# Altium project TSAL_Board_B.PrjPcb
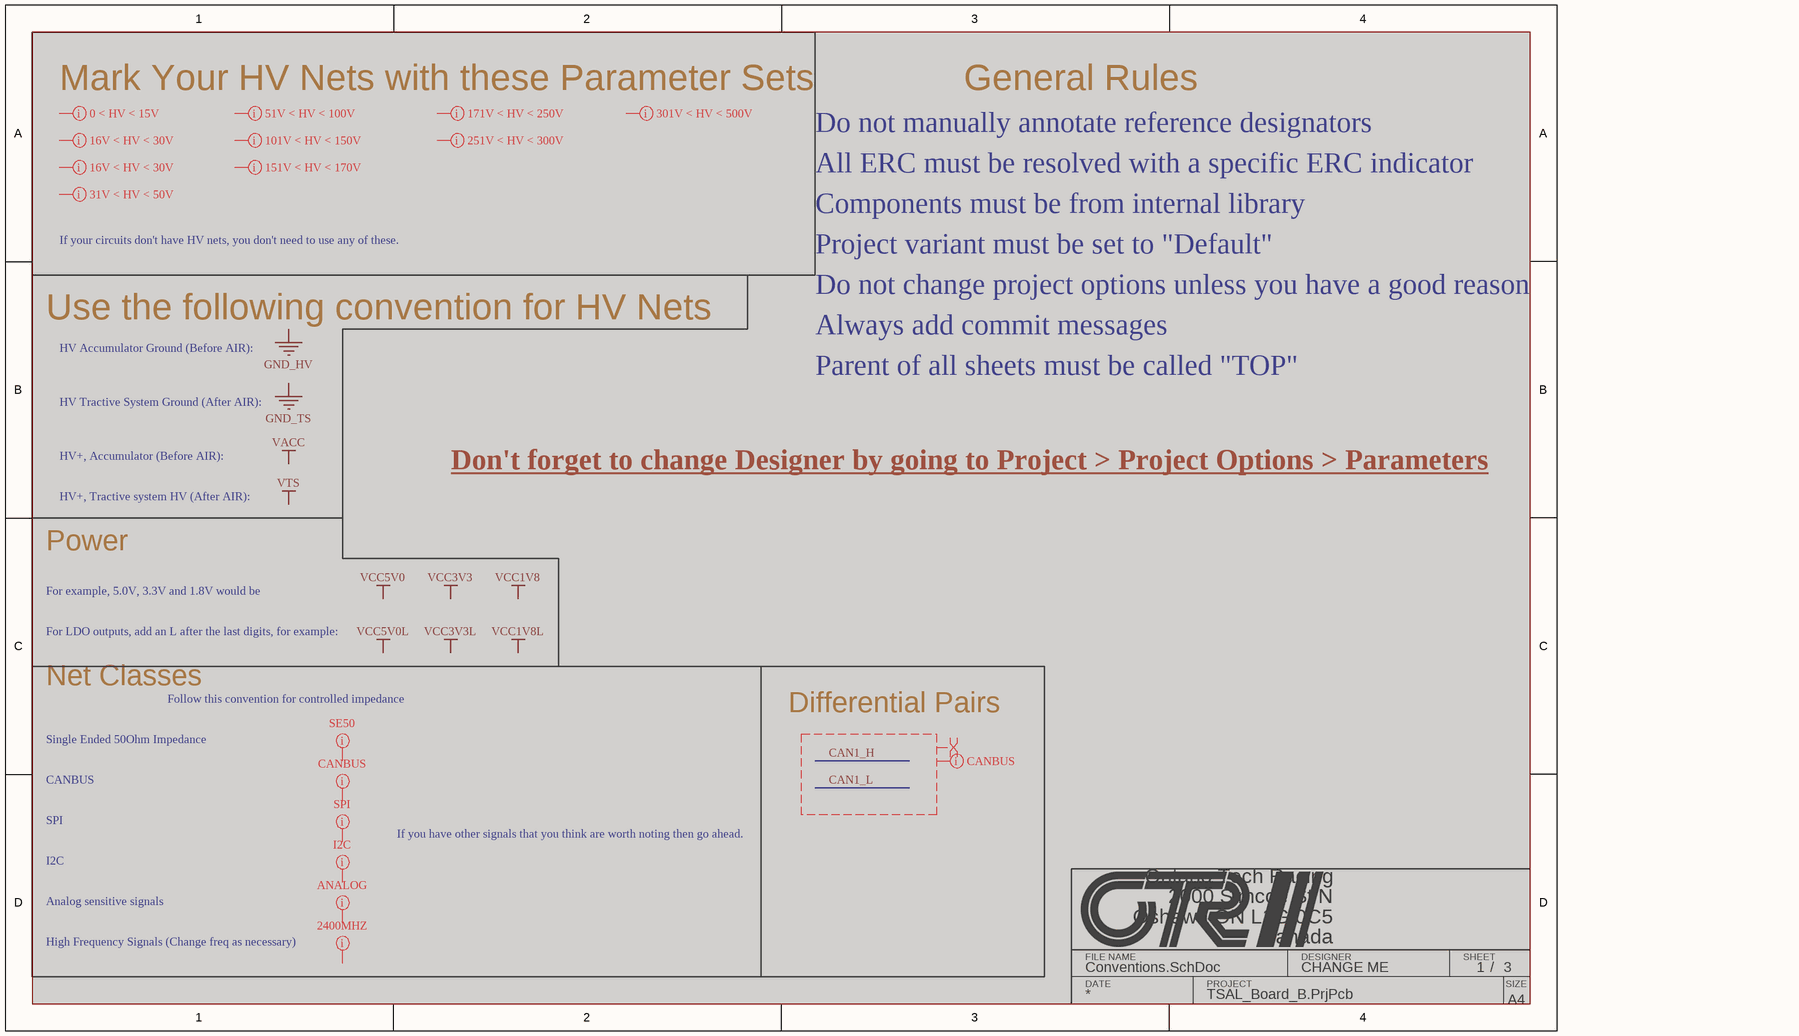
[diagram p0: Conventions.SchDoc]
DESIGNER: CHANGE ME
5 sheets, 61 parts. Net scope: hierarchical (ports join the sheet entries above them; power ports are global).
Board file: TSAL_Board_B.PcbDoc
Sheets:
  Conventions.SchDoc
  TSAL_Board_B.SchDoc
    U_TSSI = TSSI.SchDoc
      U_Red_Driver = Red_Driver.SchDoc
    U_RML = RML.SchDoc

## Sheet Conventions.SchDoc
size A4; SheetNumber: 1; SheetTotal: 3

### Layout directives
net class SE50: (no net found under the mark)
net class HV0_15: (no net found under the mark)
net class HV16_30: (no net found under the mark)
net class CANBUS: (no net found under the mark), CAN1_H, CAN1_L
net class SPI: (no net found under the mark)
net class I2C: (no net found under the mark)
net class ANALOG: (no net found under the mark)
net class 2400: (no net found under the mark)
differential pair: CAN1_H, CAN1_L

### Notes on the sheet
- Mark Your HV Nets with these Parameter Sets
- General Rules
- Do not manually annotate reference designators
- All ERC must be resolved with a specific ERC indicator
- If your circuits don't have HV nets, you don't need to use any of these.
- Components must be from internal library
- Project variant must be set to "Default"
- Do not change project options unless you have a good reason
- Use the following convention for HV Nets
- HV Accumulator Ground (Before AIR):
- Always add commit messages
- Parent of all sheets must be called "TOP"
- HV Tractive System Ground (After AIR):
- HV+, Tractive system HV (After AIR):
- HV+, Accumulator (Before AIR):
- Don't forget to change Designer by going to Project > Project Options > Parameters
- Power
- For example, 5.0V, 3.3V and 1.8V would be
- For LDO outputs, add an L after the last digits, for example:
- Net Classes
- Follow this convention for controlled impedance
- Differential Pairs
- Single Ended 50Ohm Impedance
- CANBUS
- SPI
- If you have other signals that you think are worth noting then go ahead.
- I2C
- Analog sensitive signals
- High Frequency Signals (Change freq as necessary)
- 2000 Simcoe St N
- Oshawa ON L1G 0C5
- Ontario Tech Racing
- FILE NAME
- DATE
- PROJECT
- DESIGNER
- Canada
- SHEET
- /
- A4
- SIZE

## Sheet TSAL_Board_B.SchDoc: TSAL CIRCUIT
size A; Revision: 1; SheetNumber: 2; SheetTotal: 7
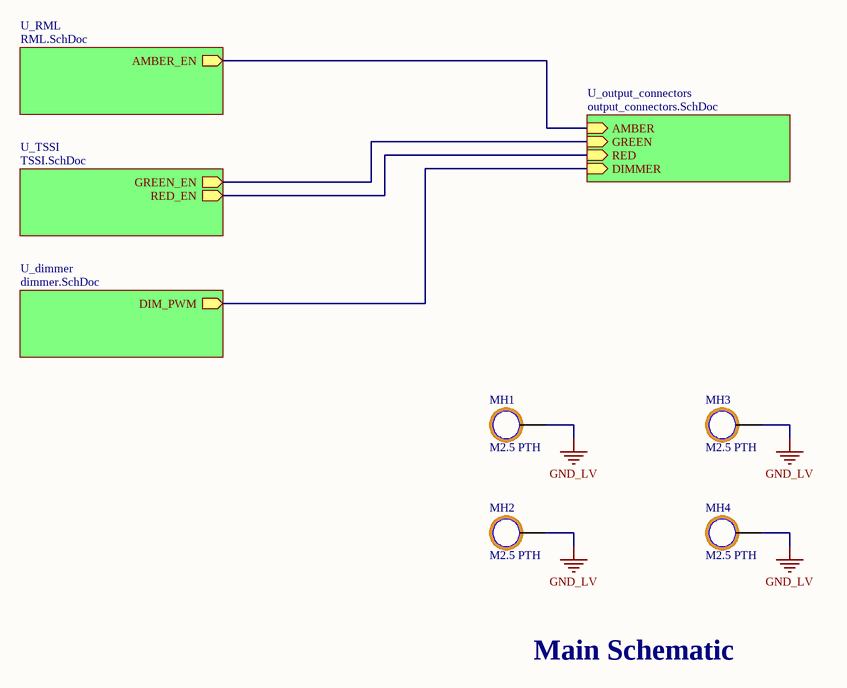
[diagram p1: TSAL_Board_B.SchDoc]

### Parts
MH1  M2.5 PTH  [MH__M2_5]  (no BOM)
MH2  M2.5 PTH  [MH__M2_5]  (no BOM)
MH3  M2.5 PTH  [MH__M2_5]  (no BOM)
MH4  M2.5 PTH  [MH__M2_5]  (no BOM)

### Sub-sheets
U_dimmer = dimmer.SchDoc (file not in this document): DIM_PWM (out)
U_output_connectors = output_connectors.SchDoc (file not in this document): AMBER (in), RED (in), GREEN (in), DIMMER (in)
U_RML = RML.SchDoc: AMBER_EN (out)
U_TSSI = TSSI.SchDoc: GREEN_EN (out), RED_EN (out)

### Nets
GND_LV: MH1.1 MH2.1 MH3.1 MH4.1
NetU4_4: sheet U_output_connectors/GREEN, sheet U_TSSI/GREEN_EN
NetU6_4: sheet U_output_connectors/RED, sheet U_TSSI/RED_EN
NetU7_4: sheet U_output_connectors/AMBER, sheet U_RML/AMBER_EN
(unnamed): sheet U_dimmer/DIM_PWM, sheet U_output_connectors/DIMMER

### Notes on the sheet
- Main Schematic

### Library data of the parts
MH1-MH4 = CMP-066-000000-1: Max Operating Temperature: °C; PN: M2.5 PTH; Min Operating Temperature: °C

## Sheet TSSI.SchDoc: TSSI CIRCUIT
size 406 x 254 mm; Revision: 1; SheetNumber: 5; SheetTotal: 7
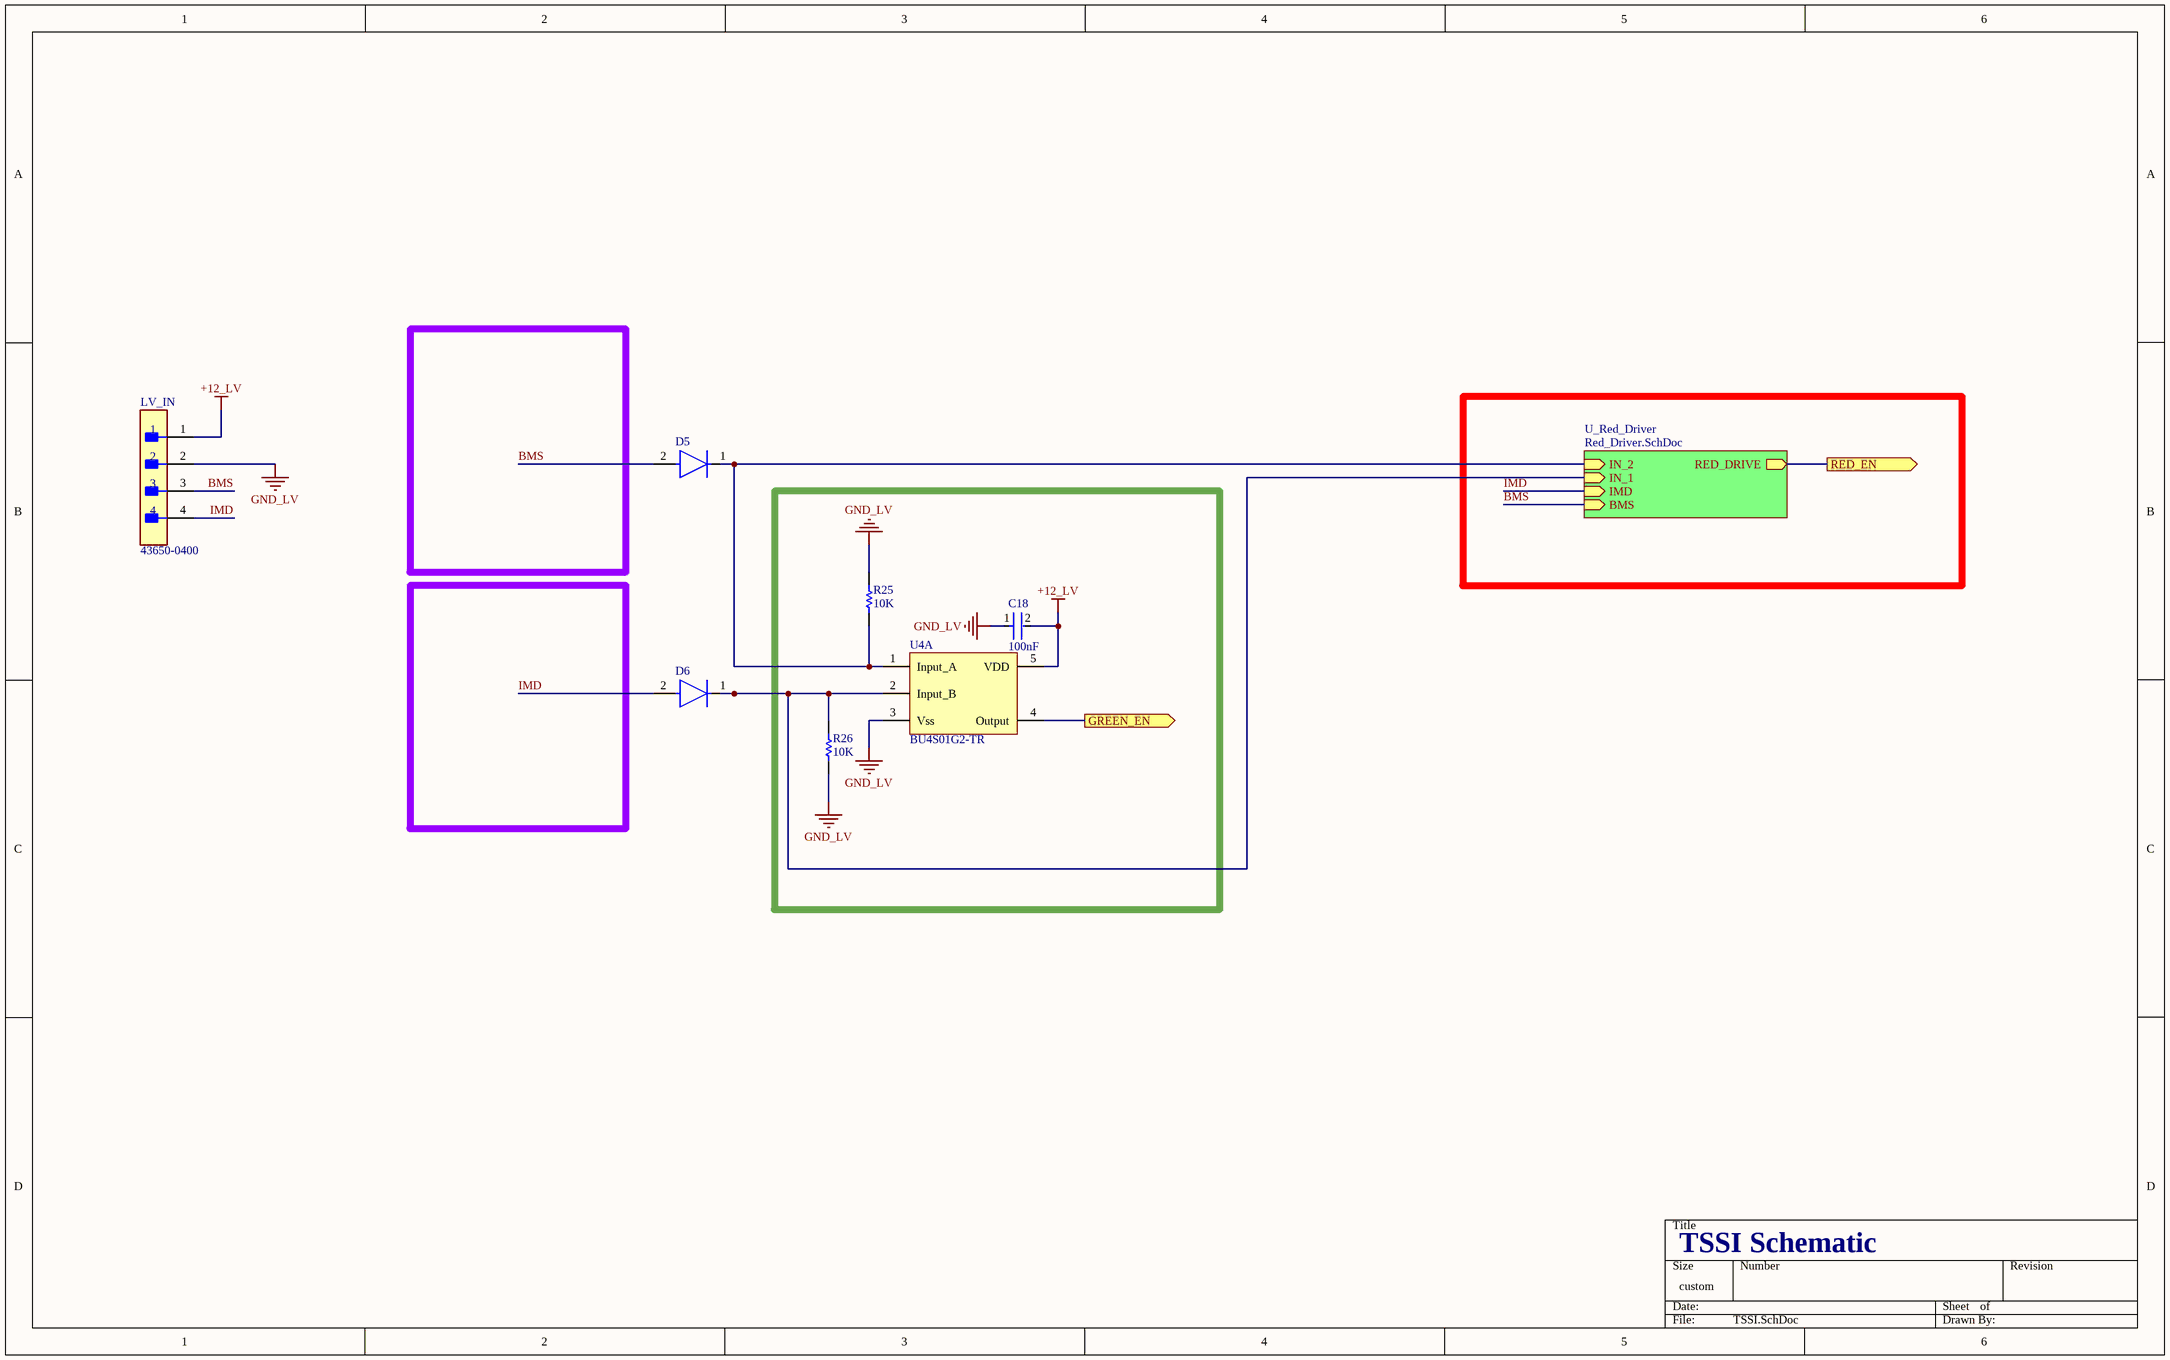
[diagram p2: TSSI.SchDoc]

### Parts
C18  100nF  [FP-C1206C-EB-MFG]
D5  DO-204AH_8_CENTRALSEMI_1  [FP-JANTXV1N486B-MFG]  (value not drawn)
D6  DO-204AH_8_CENTRALSEMI_1  [FP-JANTXV1N486B-MFG]  (value not drawn)
LV_IN  43650-0400  [FP-0436500400-MFG]
R25  10K  [R_1206_YAGEO_AC]
R26  10K  [R_1206_YAGEO_AC]
U4  BU4S01G2-TR  [SOT23__ROHM_SEMICONDUCTOR_TSZ02201]  (part A of 3)

### Sub-sheets
U_Red_Driver = Red_Driver.SchDoc: IN_2 (in), IN_1 (in), RED_DRIVE (out), IMD (in), BMS (in)

### Ports
GREEN_EN (out), RED_EN (out)

### Nets
+12_LV: C18.2 LV_IN.1 U4.5(VDD)
GND_LV: C18.1 LV_IN.2 R25.1 R26.2 U4.3(Vss)
BMS: D5.2(A) LV_IN.3 ; sheet U_Red_Driver/BMS
IMD: D6.2(A) LV_IN.4 ; sheet U_Red_Driver/IMD
NetBMS_TP_1: D6.1(C) R26.1 U4.2(Input_B) ; sheet U_Red_Driver/IN_1
NetD5_1: D5.1(C) R25.2 U4.1(Input_A) ; sheet U_Red_Driver/IN_2
NetU4_4: U4.4(Output) ; port GREEN_EN
NetU6_4: port RED_EN, sheet U_Red_Driver/RED_DRIVE

### Notes on the sheet
- TSSI Schematic

### Library data of the parts
C18 = CMP-03020-000153-1: CAP CER 0.1UF 100V X7R 1206; Manufacturer: KEMET; Manufacturer Part Number: C1206C104K1RACTU; Value: 0.10 μF; Tolerance: 0.1; Material: Ceramic; Temperature Coefficient: 15%; Automotive Grade: Grade 0; Voltage Rating: 100 V; Automotive: Yes; Ipc Land Pattern Name: CAPC320160X78; Device Class L1: Passive Components; ComponentLink2Description: Datasheet; Temperature Range Low: -55°C; Category: Cap; Octopart: https://octopart.com/c1206c104k1ractu-kemet-89521; Height: 0.88mm; Lead Free: Yes; Digikey Description: CAP CER 0.1UF 100V X7R 1206; Mouser Description: CAP CER 0.1UF 100V X7R 1206; Device Class L3: Ceramic Capacitors; Device Class L2: Capacitors; ComponentLink2URL: https://content.kemet.com/datasheets/KEM_C1007_X8R_ULTRA_150C_SMD.pdf; Temperature Range High: +150°C; Temperature Characteristic: X7R; RoHS: TRUE; Capacitance: 0.10 μF; Package: C1206C-EB; Temperature: -55°C to +150°C
D5 D6 = CMP-00002-1: Diode 250 V 200mA Through Hole DO-35; Max Inverse Voltage: 250 V; Forward Voltage: 1 V; Max Inverse Current: 50 nA; Forward Current: 100 mA; Max Operating Temperature: 200°C; Case/Package: DO-204AH; ComponentLink1Description: Datasheet
LV_IN = CMP-00257-00298074-1: 43650-0400 Connector Wire to Board Header 4 Position 3mm Solder Right Angle Thru-Hole Tray; NexarPartId: 298074; Manufacturer Lifecycle Status: ACTIVE; Glow Wire Compliant: Compliant; Voltage Rating (DC): 250V; Plating: Tin; Number of Circuits: 4; Voltage Rating: 600V; Gender: Male; Current Rating: 5A; Connector Type: Plug, Socket; Contact Resistance: 10mΩ; Height: 4.5mm; Schedule B: 8536694040, 8536694040; Housing Color: Black; Orientation: Right Angle, Vertical; Housing Material: Thermoplastic; Number of Rows: 1; Halogen Free: Low Halogen; Flammability Rating: UL94 V-0; Length: 14.86mm; REACH SVHC: Unknown; Number of Positions: 4; RoHS: Compliant; Number of Contacts: 4; Contact Material: Brass; Pitch: 3mm; Voltage Rating (AC): 250V; Number of Pins: 4; Termination: Solder; Country of Origin: US; Radiation Hardening: No; Lifecycle Status: Production; Color: Black; Contact Plating: Tin; Lead Pitch: 3mm; Max Voltage Rating (AC): 600V; Mount: Cable, Through Hole; Lead Free: Contains Lead; Max Operating Temperature: 105°C; Depth: 3.6mm; Min Operating Temperature: -40°C
R25 R26 = CMP-078-000543-1: RES SMD 10K OHM 1% 1/4W 1206; Manufacturer: YAGEO; Max Power: 0.25W, 1/4W; PN: AC1206FR-0710KL; Package: 1206 (3216 Metric); Tolerance: 1%; ComponentLink1Description: Datasheet; Max Operating Temperature: 155°C; Min Operating Temperature: -55°C; ComponentLink1URL: https://www.yageo.com/upload/media/product/productsearch/datasheet/rchip/PYu-AC_51_RoHS_L_9.pdf; Resistance Raw: 10k; Resistance: 10k
U4 = CMP-003-000051-1: NOR Gate IC 1 Channel 5-SSOP; Manufacturer: Rohm Semiconductor; Min Voltage Supply: -0.3; Max Input Voltage: V(supply); Min Input Voltage: 0; Max Voltage Supply: 18; Max Operating Temputare: 85°C; Min Operating Temputare: 40°C; PN: BU4S01G2-TR; Datasheet: https://fscdn.rohm.com/en/products/databook/datasheet/ic/logic_switch/standard_logic/bu4s01g2tr-e.pdf; PartId: 1

## Sheet Red_Driver.SchDoc
size 381 x 241 mm; SheetNumber: 6; SheetTotal: 7
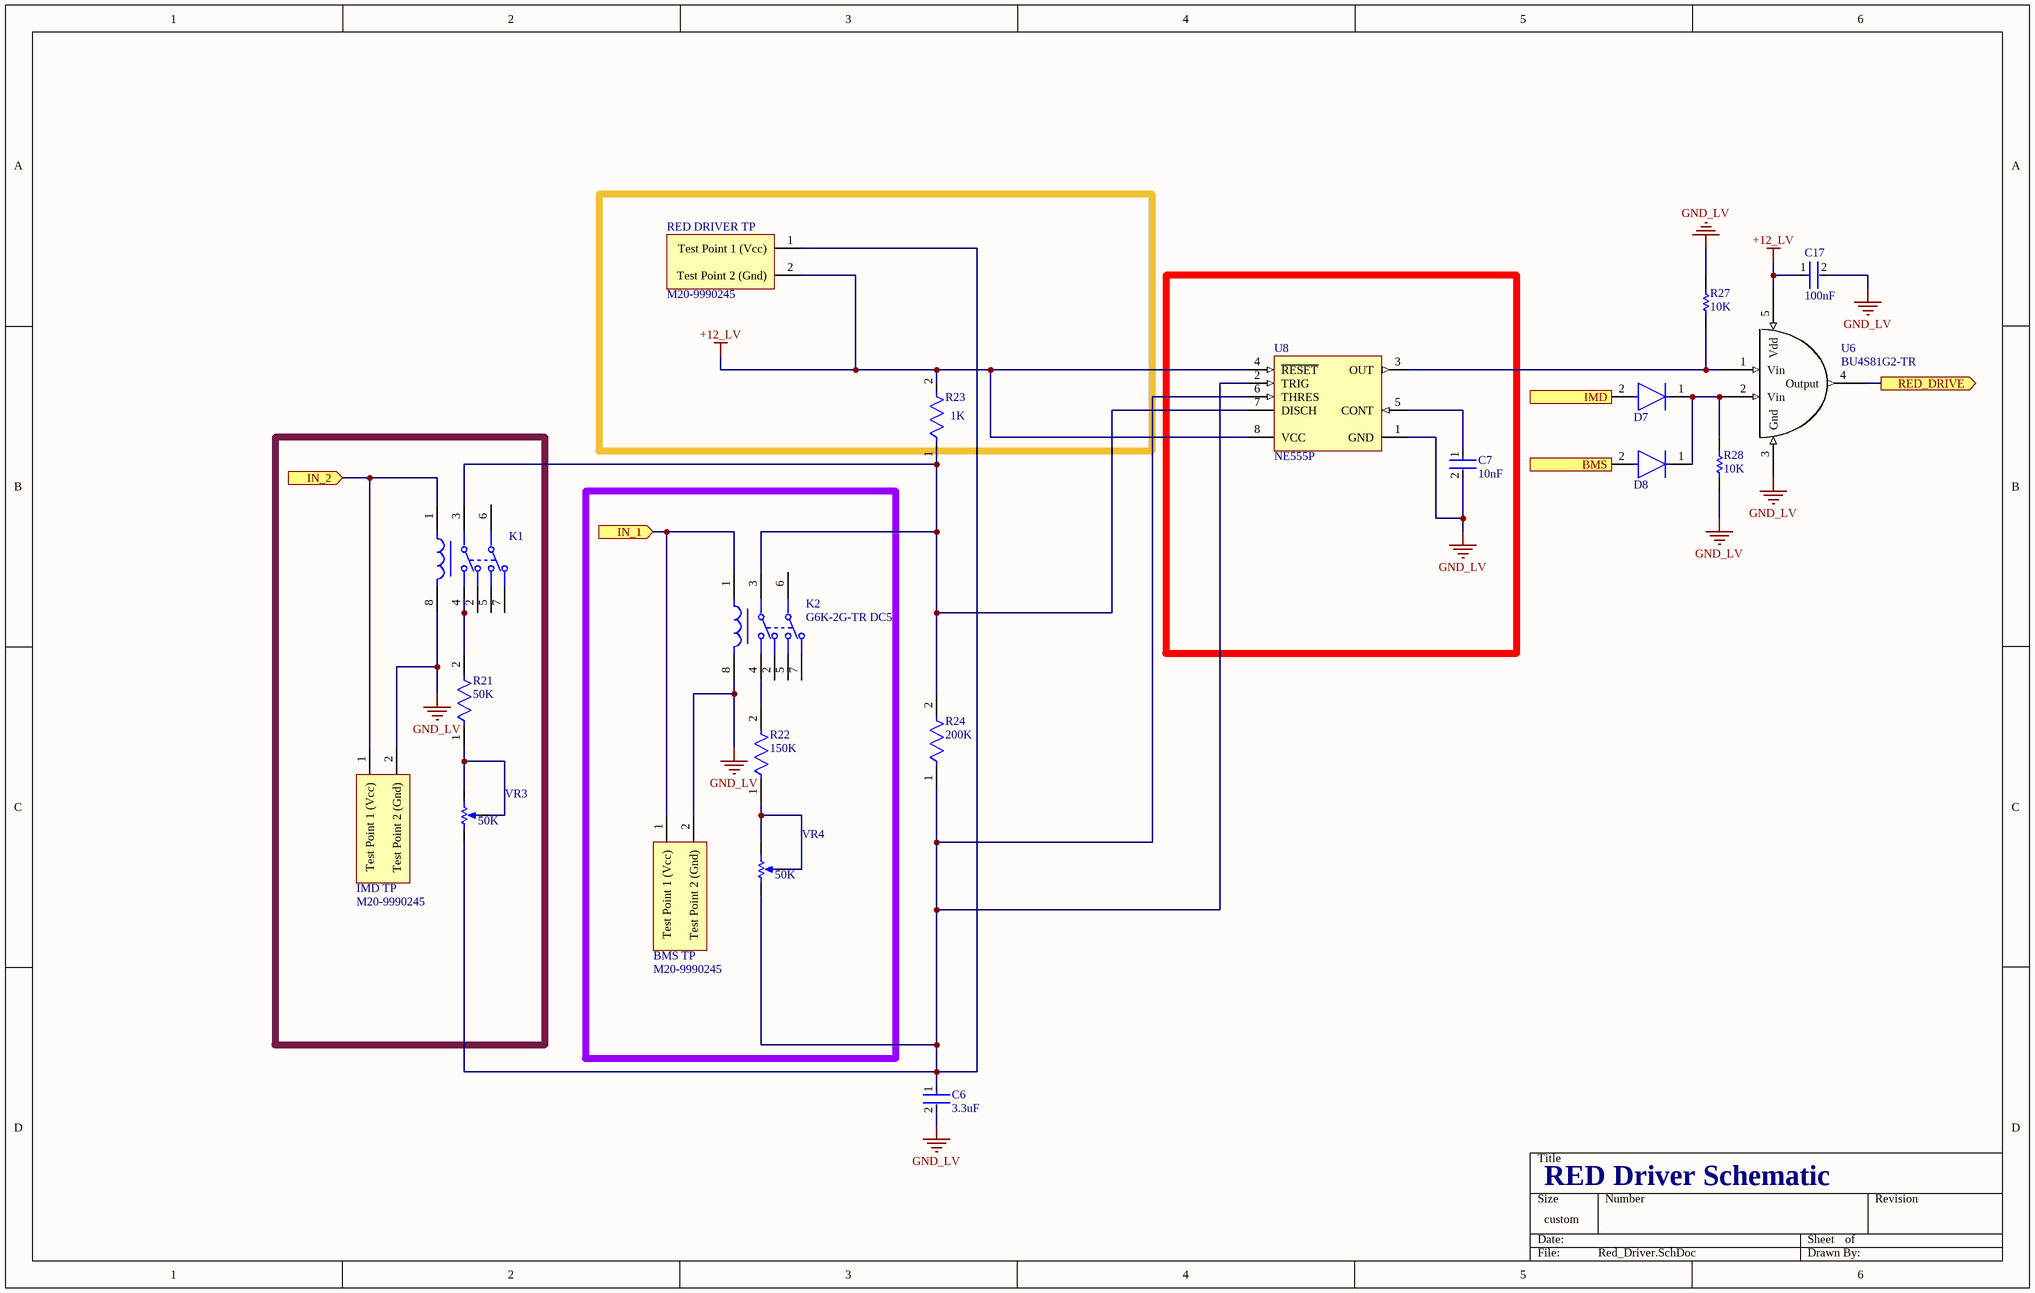
[diagram p3: Red_Driver.SchDoc]

### Parts
BMS_TP  M20-9990245  [12MM_HEADER__M20-9991245]
C6  3.3uF  [FP-RCE2K1-MFG]
C7  10nF  [FP-K155L2-MFG]
C17  100nF  [FP-C1206C-EB-MFG]
D7  DO-204AH_8_CENTRALSEMI_1  [FP-JANTXV1N486B-MFG]  (value not drawn)
D8  DO-204AH_8_CENTRALSEMI_1  [FP-JANTXV1N486B-MFG]  (value not drawn)
IMD_TP  M20-9990245  [12MM_HEADER__M20-9991245]
K1  G6K-2G-TR DC5  [FP-G6K-2G-TR_DC5-MFG]  (value not drawn)
K2  G6K-2G-TR DC5  [FP-G6K-2G-TR_DC5-MFG]
R21  50K  [RS00550K00FE73-Footprint-1]
R22  150K  [MFR-25FTE52-150K-Footprint-1]
R23  1K  [FP-RLR07-MFG]
R24  200K  [CFR-25JB-52-200K-Footprint-1]
R27  10K  [R_1206_YAGEO_AC]
R28  10K  [R_1206_YAGEO_AC]
RED_DRIVER_TP  M20-9990245  [12MM_HEADER__M20-9991245]
U6  BU4S81G2-TR  [SSOP5__ROHM_SEMICONDUCTOR__TSZ02201-0RDR0GZ00200-1-2]
U8  NE555P  [P0008A]
VR3  50K  [3006P-1-503LF-Footprint-1]
VR4  50K  [3006P-1-503LF-Footprint-1]

### Ports
BMS (in), IMD (in), IN_1 (in), IN_2 (in), RED_DRIVE (out)

### Nets
+12_LV: C17.1 R23.2 RED_DRIVER_TP.2(Test_Point_2_(Gnd)) U6.5(Vdd) U8.4(~{RESET}) U8.8(VCC)
GND_LV: BMS_TP.2(Test_Point_2_(Gnd)) C6.2 C7.2 C17.2 IMD_TP.2(Test_Point_2_(Gnd)) K1.8 K2.8 R27.1 R28.2 U6.3(Gnd) U8.1(GND)
BMS: D8.2(A) ; port BMS
IMD: D7.2(A) ; port IMD
NetBMS_TP_1: BMS_TP.1(Test_Point_1_(Vcc)) K2.1 ; port IN_1
NetC6_1: C6.1 R24.1 RED_DRIVER_TP.1(Test_Point_1_(Vcc)) U8.2(TRIG) U8.6(THRES) VR3.3(CW) VR4.3(CW)
NetC7_1: C7.1 U8.5(CONT)
NetD5_1: IMD_TP.1(Test_Point_1_(Vcc)) K1.1 ; port IN_2
NetD7_1: D7.1(C) D8.1(C) R28.1 U6.2(Vin)
NetK1_3: K1.3 K2.3 R23.1 R24.2 U8.7(DISCH)
NetK1_4: K1.4 R21.2
NetK2_4: K2.4 R22.2
NetR21_1: R21.1 VR3.1(CCW) VR3.2(WIPER)
NetR22_1: R22.1 VR4.1(CCW) VR4.2(WIPER)
NetR27_2: R27.2 U6.1(Vin) U8.3(OUT)
NetU6_4: U6.4(Output) ; port RED_DRIVE

Not connected (* = marked no-connect by the designer): K1 2 5 6 7; K2 2 5 6 7

### Notes on the sheet
- RED Driver Schematic

### Library data of the parts
BMS_TP IMD_TP RED_DRIVER_TP = CMP-081-000004-1: CONN HEADER VERT 2POS 2.54MM; Manufacturer: Harwin Inc.; PN: 952-2261-ND; Max Operating Temperature: 105 °C; Min Operating Temperature: -40 °C; ComponentLink1URL: https://www.digikey.ca/en/products/detail/harwin-inc/M20-9990245/3728225; ComponentLink1Description: Datasheet
C6 = CMP-00004-1: Ceramic Capacitor, Ceramic, 25V, 10% +Tol, 10% -Tol, X7R, -/+15ppm/Cel TC, 3.3uF, 2212; Reference Standard: AEC-Q200; Value: 3.3uF; Min Operating Temperature: -55°C; Tolerance (fill in as +-): 10%; Max Operating Temperature: 125°C; RoHS Compliant: Yes; Terminal Pitch: 5mm; Packaging: Ammo Pack; ComponentLink1Description: Datasheet; Rated DC Voltage (URdc): 25V; Width: 3.15mm; Temperature Characteristics Code: X7R; Package Style: RadialMeter; Height: 4mm; Capacitor Type: Ceramic; Reach SVHC Compliant: Yes; Case/Package: 2212; Length: 5.5mm; Dielectric Material: Ceramic; Pins: 2; Tolerance  (fill in as +-): 10%
C7 = CMP-00007-1: Ceramic Capacitor, Multilayer, Ceramic, 50V, 10% +Tol, 10% -Tol, X7R, 15% TC, 0.01uF, Through Hole Mount; Multilayer: Yes; Capacitor Type: Ceramic; Dielectric Material: Ceramic; Min Operating Temperature: -55°C; Terminal Finish: Tin; Package Shape: Rectangular; Packaging: Tape and Reel; Length: 4mm; Terminal Pitch: 2.5mm; Tolerance (fill in as +-): 10%; Value: 10nF; Tolerance  (fill in as +-): 10%; Mounting Technology: Through Hole; RoHS Compliant: Yes; JESD-609 Code: e3; Termination: Wire; ComponentLink1Description: Datasheet; Rated DC Voltage (URdc): 50V; Max Operating Temperature: 125°C; Package Style: RadialMeter; Pins: 2; Temperature Characteristics Code: X7R; Width: 2.5mm; Height: 5.58mm; Reach SVHC Compliant: Yes
C17 = CMP-03020-000153-1: as C18 on sheet TSSI; Voltage Rating: 100 V; Automotive: Yes; Ipc Land Pattern Name: CAPC320160X78; Device Class L1: Passive Components; ComponentLink2Description: Datasheet; Temperature Range Low: -55°C; Category: Cap; Octopart: https://octopart.com/c1206c104k1ractu-kemet-89521; Height: 0.88mm; Lead Free: Yes; Digikey Description: CAP CER 0.1UF 100V X7R 1206; Mouser Description: CAP CER 0.1UF 100V X7R 1206; Device Class L3: Ceramic Capacitors; Device Class L2: Capacitors; ComponentLink2URL: https://content.kemet.com/datasheets/KEM_C1007_X8R_ULTRA_150C_SMD.pdf; Temperature Range High: +150°C; Temperature Characteristic: X7R; RoHS: TRUE; Capacitance: 0.10 μF; Package: C1206C-EB; Temperature: -55°C to +150°C
D7 D8 = CMP-00002-1: as D5 on sheet TSSI; Max Operating Temperature: 200°C; Case/Package: DO-204AH; ComponentLink1Description: Datasheet
K1 K2 = CMP-08823-000110-1: RELAY TELECOM DPDT 1A 5VDC; RoHS Compliant: Yes
R21 = CMP-069-000013-1: Fixed Resistor, Wire Wound, 5W, 50000ohm, 1% +/-Tol, 20ppm/Cel, Through Hole Mount; Min Operating Temperature: -65°C; ComponentLink1Description: Datasheet; Max Operating Temperature: 250°C; Tolerance: 1%
R22 = CMP-069-000014-1: Fixed Resistor, Metal Film, 0.25W, 150000ohm, 250V, 1% +/-Tol, -50,50ppm/Cel; ComponentLink1Description: Datasheet
R23 = CMP-00030-39447724-1: RLR07C1001FSB14 Fixed Resistor, Metal Film, 0.25W, 1000ohm, 250V, 1% +/-Tol, 100ppm/Cel, Through Hole Mount; Wire/Cable Diameter: 50.8µm; Lead Diameter: 640µm; Max Power Dissipation: 250mW; Temperature Coefficient: 100ppm/°C; Resistance: 100Ω; Lead Length: 38.1mm; Voltage Rating: 250V; Lead Free: Contains Lead; REACH SVHC: Unknown; Packaging: Bulk; Military Standard: MIL-PRF-39017; Width: 2.29mm; Max Operating Temperature: 150°C; Length: 7.62mm; Min Operating Temperature: -65°C; Composition: Metal Film; Diameter: 2.29mm; Radiation Hardening: No; Features: Military, Moisture Resistant, Weldable; Failure Rate: 0.001%; Case/Package: Conformal; Tolerance: 1%; Voltage Rating (DC): 250V; Schedule B: 8533210090, 8533210090; RoHS: Non-Compliant; Termination: Axial; Power Rating: 250mW; Contact Plating: Lead, Tin; NexarPartId: 39447724; Number of Terminations: 2; Number of Pins: 14
R24 = CMP-069-000015-1: Fixed Resistor, Carbon Film, 0.25W, 200000ohm, 250V, 5% +/-Tol, -700,0ppm/Cel, Through Hole Mount; Min Operating Temperature: -55°C; Tolerance: 5%; ComponentLink1Description: Datasheet; Max Operating Temperature: 155°C
R27 R28 = CMP-078-000543-1: as R25 on sheet TSSI; Package: 1206 (3216 Metric); Tolerance: 1%; ComponentLink1Description: Datasheet; Max Operating Temperature: 155°C; Min Operating Temperature: -55°C; ComponentLink1URL: https://www.yageo.com/upload/media/product/productsearch/datasheet/rchip/PYu-AC_51_RoHS_L_9.pdf; Resistance Raw: 10k; Resistance: 10k
U6 = CMP-003-000056-1: IC GATE AND 1CH 2-INP 5SSOP; Min-Max Input: 0V - V(supp); Temputare Range: -40°C to +85°C; Min-Max Supply Voltage: 3V to 16V; PN: BU4S81G2-TR; Datasheet: https://fscdn.rohm.com/en/products/databook/datasheet/ic/logic_switch/standard_logic/bu4s81g2-e.pdf
U8 = CMP-2000-04954-1: Precision Timer, 4.5 to 16 V, 0 to 70 degC, 8-Pin DIP, Pb-Free, Tube; Manufacturer: TexasInstruments; Maximum High Level Output Current: -200mA; Number of Internal Timers: 1; Operating Supply Voltage: 5; Maximum Low Level Output Current: 200mA; Rad Hard: No; Packaging: Rail/Tube; Manufacturer URL: http://www.ti.com/; Package Reference: P8; Package Description: 8-Pin Double In-line Package, Body 9.59 x 6.35 mm, Pitch 2.54 mm; Package URL: http://www.ti.com/lit/ml/mpdi001b/mpdi001b.pdf; Type: Standard; Datasheet URL: http://www.ti.com/general/docs/lit/getliterature.tsp?genericPartNumber=NE555&fileType=pdf; Category: Timer; Package: 8PDIP; Datasheet Version: Rev. I, 09/2014
VR3 VR4 = CMP-069-000016-1: Trimmer, Cermet, 0.75W, 50000ohm, 400V, 10% +/-Tol, -100,100ppm/Cel, 15 Turn(s), 7519; Tolerance: 10%; ComponentLink1Description: Datasheet; Max Operating Temperature: 125°C; Min Operating Temperature: -55°C

## Sheet RML.SchDoc: RML CIRCUIT
size 482 x 304 mm; Revision: 1; SheetNumber: 7; SheetTotal: 7
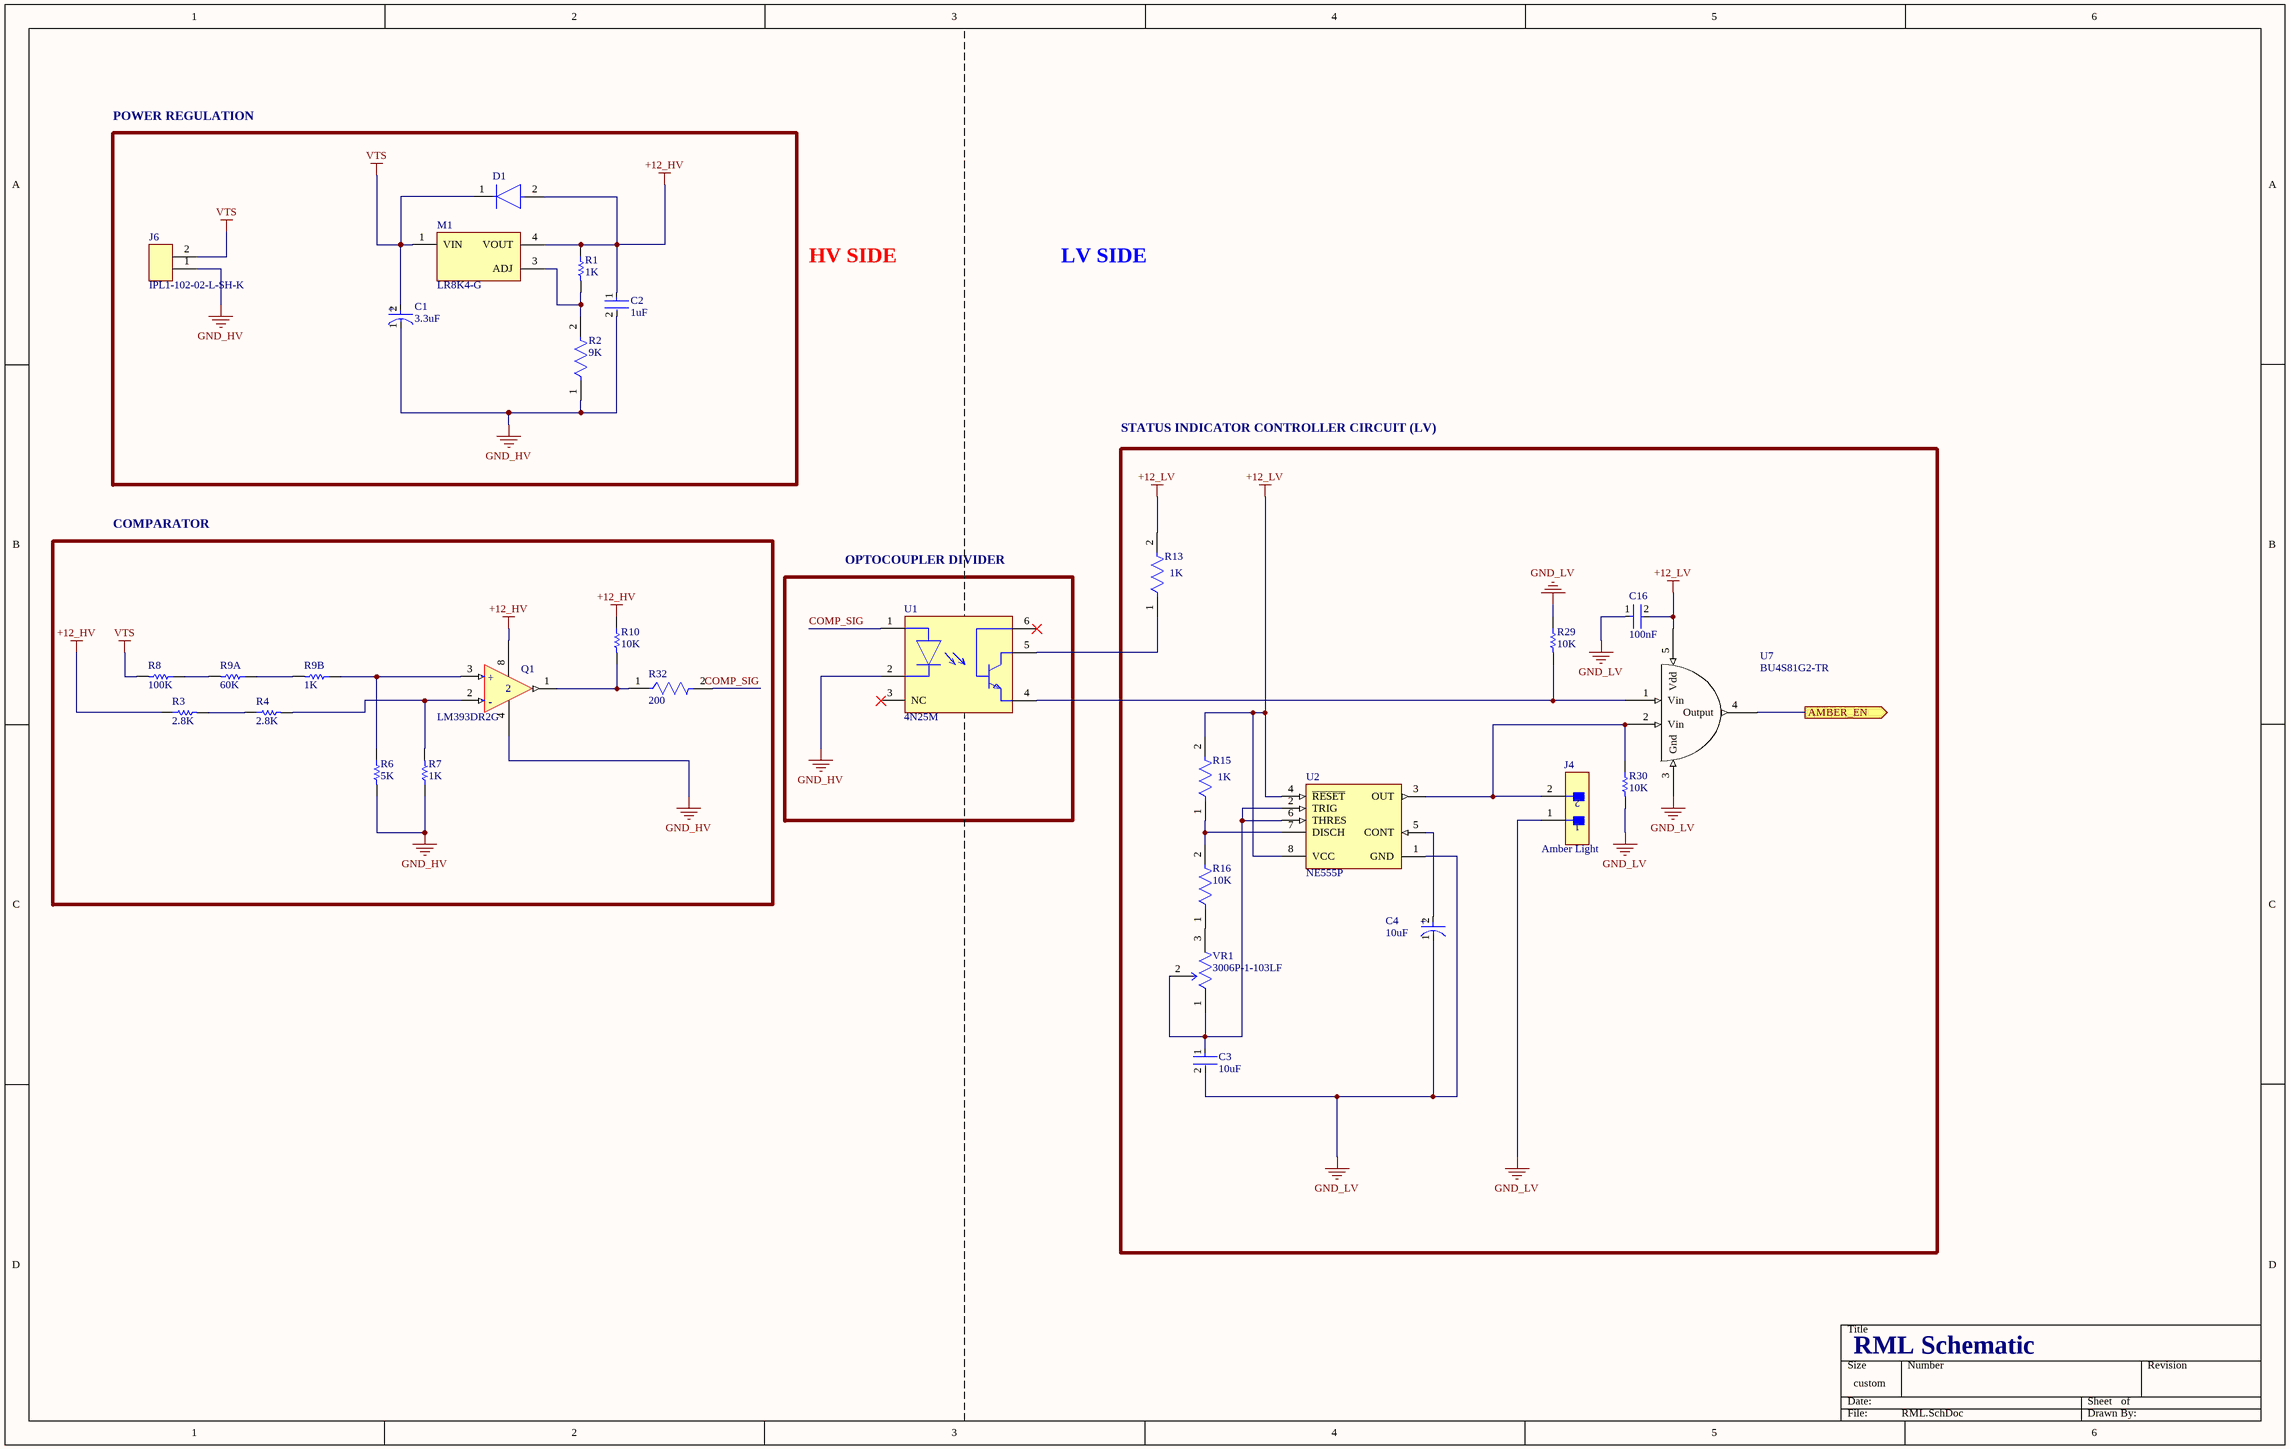
[diagram p4: RML.SchDoc]

### Parts
C1  3.3uF  [FP-RAD-TH-D_10_0_5-L_12_5-MFG]
C2  1uF  [FP-RCE2K1-MFG]
C3  10uF  [FP-RCE3DB-MFG]
C4  10uF  [FP-RAD-TH-D_5_0_5-L_11_1-MFG]
C16  100nF  [FP-C1206C-EB-MFG]
D1  1N4007-TP  [FP-1N4007-TP-MFG]  (value not drawn)
J4  Amber Light  [FP-M20-9990246-MFG]
J6  IPL1-102-02-L-SH-K  [J__SAMTEC_IPL1-102-02-XXX-SH-K]
M1  LR8K4-G  [FP-C04-189-MFG]
Q1  LM393DR2G  [SOIC8_ONSEMI_LM393DR2G_2N]
R1  1K  [R_1206_YAGEO_AC]
R2  9K  [FP-MCA1206-IPC_B]
R3  2.8K  [RESC3116X65X40ML10T20]
R4  2.8K  [RESC3116X65X40ML10T20]
R6  5K  [R_2512_YAGEO_AC]
R7  1K  [R_1206_YAGEO_AC]
R8  100K  [R_2512_YAGEO_AC]
R9A  60K  [RESC__2512__VISHAY_DALE__20035N]
R9B  1K  [R_2512_YAGEO_AC]
R10  10K  [R_1206_YAGEO_AC]
R13  1K  [FP-RLR07-MFG]
R15  1K  [FP-RLR07-MFG]
R16  10K  [FP-RLR07-MFG]
R29  10K  [R_1206_YAGEO_AC]
R30  10K  [R_1206_YAGEO_AC]
R32  200  [FP-RMCF1206-IPC_A]
U1  4N25M  [FP-646BX-MFG]
U2  NE555P  [P0008A]
U7  BU4S81G2-TR  [SSOP5__ROHM_SEMICONDUCTOR__TSZ02201-0RDR0GZ00200-1-2]
VR1  3006P-1-103LF  [FP-3006P-MFG]

### Blocks framed on the sheet
POWER REGULATION: C1 C2 D1 J6 M1 R1 R2
STATUS INDICATOR CONTROLLER CIRCUIT (LV): C3 C4 C16 J4 R13 R15 R16 R29 R30 U2 U7 VR1
COMPARATOR: Q1 R3 R4 R6-R8 R9A R9B R10 R32
OPTOCOUPLER DIVIDER: U1

### Ports
AMBER_EN (out)

### Nets
+12_HV: C2.1 D1.2(A) M1.4(VOUT) Q1.8(VCC_(+)) R1.1 R3.1 R10.1
+12_LV: C16.2 R13.2 R15.2 U2.4(~{RESET}) U2.8(VCC) U7.5(Vdd)
GND_HV: C1.1(C) C2.2 J6.1 Q1.4(VCC_(-)) R2.1 R6.2 R7.1 U1.2(C)
GND_LV: C3.2 C4.1(C) C16.1 J4.1 R29.1 R30.2 U2.1(GND) U7.3(Gnd)
VTS: C1.2(A) D1.1(C) J6.2 M1.1(VIN) R8.2
COMP_SIG: R32.2 U1.1(A)
NetC3_1: C3.1 U2.2(TRIG) U2.6(THRES) VR1.1(CCW) VR1.2(WIPER)
NetC4_2: C4.2(A) U2.5(CONT)
NetJ4_2: J4.2 R30.1 U2.3(OUT) U7.2(Vin)
NetM1_3: M1.3(ADJ) R1.2 R2.2
NetQ1_1: Q1.1(OUTPUT_B) R10.2 R32.1
NetQ1_2: Q1.2(INPUT_B-) R4.2 R7.2
NetQ1_3: Q1.3(INPUT_B+) R6.1 R9B.1
NetR3_2: R3.2 R4.1
NetR8_1: R8.1 R9A.2
NetR9A_1: R9A.1 R9B.2
NetR13_1: R13.1 U1.5(C)
NetR15_1: R15.1 R16.2 U2.7(DISCH)
NetR16_1: R16.1 VR1.3(CW)
NetR29_2: R29.2 U1.4(E) U7.1(Vin)
NetU7_4: U7.4(Output) ; port AMBER_EN

Not connected (* = marked no-connect by the designer): U1 3(NC)* 6(B)*

### Notes on the sheet
- HV SIDE
- LV SIDE
- RML Schematic
- (in symbol CMP-003-000045-1) +; -
- (in symbol CMP-00008-1) +
- (in symbol CMP-05427-001012-1) +

### Library data of the parts
C1 = CMP-05427-001012-1: Aluminum Electrolytic Capacitors (Radial Lead Type) 3.3uF ±20% 400V; Dielectric Material: Aluminium; Ripple Current (AC): 40mA; Lead/Base Style: Straight; Life (Hours): 2000Hour; Lead Diameter: 0.6mm; Polarity: Polar; Voltage Rating (DC): 400V; Max Operating Temperature: 105°C; Lead Pitch: 5mm; Termination: Radial; Lead Free: Lead Free; Radiation Hardening: No; Voltage Rating: 400V; Tolerance: 20%; Construction: RADIAL; Ripple Current: 40mA; Min Operating Temperature: -25°C; Diameter: 10mm; Contact Plating: Tin; Package Quantity: 200; Mount: Through Hole; REACH SVHC: No SVHC; Height: 12.5mm; Case/Package: Radial; Height - Seated (Max): 0.531inch; RoHS Compliant: Yes; Series: NHG; Capacitance: 3.3uF; Packaging: Bulk; Number of Pins: 2; Voltage: 400V; Length: 12.5mm
C2 = CMP-00005-1: Ceramic Capacitor, Multilayer, Ceramic, 100V, 10% +Tol, 10% -Tol, X7R, 15% TC, 1uF, Through Hole Mount, 2212; Reference Standard: AEC-Q200; Reach SVHC Compliant: Yes; Capacitor Type: Ceramic; Pins: 2; Value: 1uF; Package Style: RadialMeter; Length: 5.5mm; Dielectric Material: Ceramic; Packaging: Ammo Pack; Tolerance  (fill in as +-): 10%; Height: 4mm; ComponentLink1Description: Datasheet; Min Operating Temperature: -55°C; Terminal Pitch: 5mm; RoHS Compliant: Yes; Width: 3.15mm; Case/Package: 2212; Rated DC Voltage (URdc): 100V; Tolerance (fill in as +-): 10%; Max Operating Temperature: 125°C; Temperature Characteristics Code: X7R
C3 = CMP-00006-1: Ceramic Capacitor, Multilayer, Ceramic, 25V, 10% +Tol, 10% -Tol, X7R, 15% TC, 10uF, Through Hole Mount, 2216; Reference Standard: AEC-Q200; Reach SVHC Compliant: Yes; Dielectric Material: Ceramic; Tolerance  (fill in as +-): 10%; Min Operating Temperature: -55°C; Terminal Pitch: 2.5mm; ComponentLink1Description: Datasheet; Width: 4mm; Temperature Characteristics Code: X7R; Capacitor Type: Ceramic; Max Operating Temperature: 125°C; Length: 5.5mm; Case/Package: 2216; Tolerance (fill in as +-): 10%; Packaging: Ammo Pack; Height: 5mm; Rated DC Voltage (URdc): 25V; Pins: 2; RoHS Compliant: Yes; Package Style: RadialMeter; Value: 10uF
C4 = CMP-00008-1: Aluminum Electrolytic Capacitor, Polarized, Aluminum (wet), 50V, 20% +Tol, 20% -Tol, 10uF, Through Hole Mount; Manufacturer Series: NHG; Ripple Current: 39mA; Leakage Current: 5uA; Capacitor Type: Aluminium; Tan Delta: 0.12; Packaging: Tape and Reel; Termination: Wire; Value: 10uF; Reach SVHC Compliant: Yes; Terminal Finish: Tin; Diameter: 5mm; Min Operating Temperature: -55°C; Series: ECA-NHG; Max Operating Temperature: 105°C; Package Shape: Cylindrical; Rated DC Voltage (URdc): 50V; RoHS Compliant: Yes; Package Style: RadialMeter; Pins: 2; Tolerance (fill in as +-): 20%; Terminal Pitch: 2.5mm; Tolerance  (fill in as +-): 20%; Polarity: Polarized; Length: 11mm; ComponentLink1Description: Datasheet; Dielectric Material: Aluminium; Mounting Technology: Through Hole; JESD-609 Code: e3
C16 = CMP-03020-000153-1: as C18 on sheet TSSI; Voltage Rating: 100 V; Automotive: Yes; Ipc Land Pattern Name: CAPC320160X78; Device Class L1: Passive Components; ComponentLink2Description: Datasheet; Temperature Range Low: -55°C; Category: Cap; Octopart: https://octopart.com/c1206c104k1ractu-kemet-89521; Height: 0.88mm; Lead Free: Yes; Digikey Description: CAP CER 0.1UF 100V X7R 1206; Mouser Description: CAP CER 0.1UF 100V X7R 1206; Device Class L3: Ceramic Capacitors; Device Class L2: Capacitors; ComponentLink2URL: https://content.kemet.com/datasheets/KEM_C1007_X8R_ULTRA_150C_SMD.pdf; Temperature Range High: +150°C; Temperature Characteristic: X7R; RoHS: TRUE; Capacitance: 0.10 μF; Package: C1206C-EB; Temperature: -55°C to +150°C
D1 = CMP-56207-000011-1: DIODE GEN PURP 1KV 1A DO41; Max Surge Current: 30A; Recovery Time: 2000ns; Element Configuration: Single; Polarity: Standard; Reverse Recovery Time: 2us; Capacitance: 15pF; Forward Voltage: 1V; Max Reverse Current: 5uA; Radiation Hardening: No; Number of Pins: 2; Current Rating: 1A; Reverse Voltage: 1kV; Output Current: 1A; Mount: Through Hole; Average Rectified Current: 1A; Lead Free: Lead Free; Peak Non-Repetitive Surge Current: 30A; Max Reverse Voltage (DC): 1kV; Voltage Rating (DC): 1kV; Max Repetitive Reverse Voltage (Vrrm): 1kV; Diameter: 2.7mm; Forward Current: 1A; RoHS Compliant: Yes; Package Quantity: 1; Length: 5.2mm; Max Forward Surge Current (Ifsm): 30A; Packaging: Tape and Reel; Case/Package: DO-41; Min Operating Temperature: -55°C; Max Operating Temperature: 150°C
J4 = CMP-15831-000009-1: CONN HEADER VERT 2POS 2.54MM; Manufacturer: Harwin; Manufacturer Part Number: M20-9990246; Conn Gender: Male; Conn Orientation: Vertical; Number Of Contacts: 2; Current Rating: 3A; ComponentLink2URL: https://cdn.harwin.com/pdfs/M20-999.pdf; ComponentLink2Description: Datasheet; Package: M20-9990246; Temperature: -40°C to +105°C; Octopart: https://octopart.com/m20-9990246-harwin-2590635; Mouser Description: 2.54mm (0.1") Pitch SIL Vertical PC Tail Pin Header, 6.1mm mating pin height, tin, 2 contacts; Temperature Range High: +105°C; Device Class L1: Connectors; RoHS: TRUE; Automotive: No; Height: 8.99mm; Number Of Rows: 1; Contact Material: Tin,Nickel; Category: Conn; Pitch: 2.54mm; Lead Free: Yes; Digikey Description: CONN HEADER VERT 2POS 2.54MM; Temperature Range Low: -40°C; Device Class L3: unset; Device Class L2: Headers and Wire Housings
J6 = CMP-044-000010-1: Connector Header Surface Mount, Right Angle 2 position 0.100" (2.54mm); Manufacturer: Samtec; Current Rating: 3.8A; Voltage Rating (Working): 954VDC; Gender: Male; Pin Count: 2; PN: IPL1-102-02-L-SH-K; ComponentLink1Description: Datasheet; ComponentLink1URL: http://suddendocs.samtec.com/catalog_english/ipl1.pdf; Type: Surface-Mount
M1 = CMP-06324-000005-1: IC REG LINEAR POS ADJ 10MA TO252; Manufacturer: Microchip; Standoff Height: 0mm; Nominal Supply Current: 10uA; Min Supply Voltage: 13.2V; Number Of Outputs: 1; Max Power Dissipation: 2.5W; Description: Linear Voltage Regulator IC Positive Adjustable 1 Output 10mA TO-252, (D-Pak); Max Junction Temp: +125°C; Max Supply Voltage: 450V; Accuracy Percentage: 5%; Output Type: AdjustableProgrammable; Output Current: 0.3-30mA; Output Voltage: 1.2-440V; Device Class L1: Integrated Circuits (ICs); Temperature Range High: +125°C; RoHS: TRUE; Footprint Url: http://ww1.microchip.com/downloads/en/DeviceDoc/3L_DPAK_%28TO-252%29_U5X_C04-00189a.pdf; ComponentLink2Description: Datasheet; Ambient Temperature Range High: +85°C; Octopart: https://octopart.com/lr8k4-g-microchip-47153542; Mouser Description: Linear Voltage Regulators 450V Adj 3 Termnl; Device Class L3: Voltage Regulators - Linear; Height: 0.099inch; Device Class L2: Power Management ICs; Automotive: No; Digikey Description: IC REG LINEAR POS ADJ 10MA TO252; Temperature: -40°C to +125°C; Lead Free: Yes; Ambient Temperature Range Low: -40°C; Manufacturer Part Number: LR8K4-G; Category: Trans; Temperature Range Low: -40°C; ComponentLink2URL: http://ww1.microchip.com/downloads/en/DeviceDoc/20005399B.pdf; Package: C04-189
Q1 = CMP-003-000045-1: Comparator General Purpose Open-Collector, Rail-to-Rail 8-SOIC; Manufacturer: Onsemi; PN: LM393DR2GOSTR-ND; Voltage Supply Max: 2V ~ 36V,; Number of IO: 3; Type: IC Comparator; Voltage Supply Min: ±1V ~ 18V; Datasheet: https://www.onsemi.com/pdf/datasheet/lm393-d.pdf; Min Operating Temperature: 0°C; Max Operating Temperature: 70°C
R1 R7 = CMP-078-000581-1: RES SMD 1K OHM 1% 1/4W 1206; Manufacturer: YAGEO; Max Power: 0.25W, 1/4W; PN: AC1206FR-071KL; Package: 1206 (3216 Metric); Min Operating Temperature: -55°C; Resistance: 1k; ComponentLink1URL: https://www.yageo.com/upload/media/product/productsearch/datasheet/rchip/PYu-AC_51_RoHS_L_9.pdf; Max Operating Temperature: 155°C; Tolerance: 1%; ComponentLink1Description: Datasheet; Resistance Raw: 1k
R2 = CMP-069-000006-1: Fixed Resistor, Thin Film, 0.25W, 9000ohm, 200V, 0.1% +/-Tol, 25ppm/Cel, Surface Mount, 1206; Tolerance: 0.1%; ComponentLink1Description: Datasheet; Max Operating Temperature: 125°C; Min Operating Temperature: -55°C
R3 R4 = CMP-069-000009-1: Fixed Resistor, Metal Glaze/thick Film, 0.25W, 2800ohm, 200V, 1% +/-Tol, 100ppm/Cel, Surface Mount, 1206; Min Operating Temperature: -55°C; Tolerance: 1%; ComponentLink1Description: Datasheet; Max Operating Temperature: 155°C
R6 = CMP-078-000884-1: RES SMD 4.99K OHM 1% 1W 2512; Manufacturer: YAGEO; PN: AC2512FK-074K99L; Min Operating Temperature: -55°C; Resistance: 4.99k; ComponentLink1URL: https://www.yageo.com/upload/media/product/productsearch/datasheet/rchip/PYu-AC_51_RoHS_L_9.pdf; Max Power: 1W; ComponentLink1Description: Datasheet; Resistance Raw: 4.99k; Max Operating Temperature: 155°C; Package: 2512 (6432 Metric); Tolerance: 1%
R8 = CMP-078-000825-1: RES SMD 100K OHM 1% 1W 2512; Manufacturer: YAGEO; PN: AC2512FK-07100KL; ComponentLink1Description: Datasheet; ComponentLink1URL: https://www.yageo.com/upload/media/product/productsearch/datasheet/rchip/PYu-AC_51_RoHS_L_9.pdf; Min Operating Temperature: -55°C; Package: 2512 (6432 Metric); Resistance: 100k; Max Operating Temperature: 155°C; Max Power: 1W; Resistance Raw: 100k; Tolerance: 1%
R9A = CMP-069-000019-1: RES SMD 60.4K OHM 1% 1W 2512; Manufacturer: Vishay Dale; Tolerance: 5%; PN: 541-CRCW251260K4FKEGCT-ND; Max Operating Temperature: -55 °C; Resistance Raw: 60.4k; Resistance: 60.4k; ComponentLink1URL: https://www.vishay.com/docs/20035/dcrcwe3.pdf; Max Power: 1W; Package: 2512; Min Operating Temperature: 155 °C; ComponentLink1Description: Datasheet
R9B = CMP-078-000840-1: RES SMD 1K OHM 1% 1W 2512; Manufacturer: YAGEO; PN: AC2512FK-071KL; Max Operating Temperature: 155°C; Tolerance: 1%; Resistance: 1k; ComponentLink1Description: Datasheet; Min Operating Temperature: -55°C; Max Power: 1W; Resistance Raw: 1k; ComponentLink1URL: https://www.yageo.com/upload/media/product/productsearch/datasheet/rchip/PYu-AC_51_RoHS_L_9.pdf; Package: 2512 (6432 Metric)
R10 R29 R30 = CMP-078-000543-1: as R25 on sheet TSSI; Package: 1206 (3216 Metric); Tolerance: 1%; ComponentLink1Description: Datasheet; Max Operating Temperature: 155°C; Min Operating Temperature: -55°C; ComponentLink1URL: https://www.yageo.com/upload/media/product/productsearch/datasheet/rchip/PYu-AC_51_RoHS_L_9.pdf; Resistance Raw: 10k; Resistance: 10k
R13 R15 = CMP-00030-39447724-1: as R23 on sheet Red_Driver; Voltage Rating: 250V; Lead Free: Contains Lead; REACH SVHC: Unknown; Packaging: Bulk; Military Standard: MIL-PRF-39017; Width: 2.29mm; Max Operating Temperature: 150°C; Length: 7.62mm; Min Operating Temperature: -65°C; Composition: Metal Film; Diameter: 2.29mm; Radiation Hardening: No; Features: Military, Moisture Resistant, Weldable; Failure Rate: 0.001%; Case/Package: Conformal; Tolerance: 1%; Voltage Rating (DC): 250V; Schedule B: 8533210090, 8533210090; RoHS: Non-Compliant; Termination: Axial; Power Rating: 250mW; Contact Plating: Lead, Tin; NexarPartId: 39447724; Number of Terminations: 2; Number of Pins: 14
R16 = CMP-069-000004-1: Fixed Resistor, Metal Film, 0.25W, 100000ohm, 250V, 1% +/-Tol, 100ppm/Cel, Through Hole Mount; Max Operating Temperature: 150°C; ComponentLink1Description: Datasheet; Tolerance: 1%; Min Operating Temperature: -65°C
R32 = CMP-26527-004145-1: 220Ω ±5% 0.25W 1206 Thick Film Chip Resistor AEC-Q200 compliant; Max Power Dissipation: 250mW; Resistance: 220R; Temperature Coefficient: 200ppm/°C; Series: RMCF; Mount: Surface Mount; Construction: Rectangular; Packaging: Tape and Reel; Contact Plating: Tin; Military Standard: Not; Min Operating Temperature: -55°C; Resistor Type: Thick Film; Features: Automotive AEC-Q200; Case Code (Metric): 3216; Case/Package: 1206; Depth: 1.6mm; Tolerance: 5%; Case Code (Imperial): 1206; Height: 0.028inch; Length: 0.126inch; Size Code: 1206; Lead Free: Lead Free; Radiation Hardening: No; Power Rating: 250mW; Width: 0.063inch; RoHS Compliant: Yes; Max Operating Temperature: 155°C; Number of Terminations: 2
U1 = CMP-00278-84323282-1: 4N25M Optocoupler DC-IN 1-CH Transistor With Base DC-OUT 6-Pin PDIP Tube - Bulk; Manufacturer Lifecycle Status: ACTIVE; Isolation Voltage: 7.5kV; Number of Circuits: 1; Collector Emitter Voltage (VCEO): 500mV; Max Junction Temperature (Tj): 125°C; Collector Emitter Breakdown Voltage: 30V; Forward Current: 10mA; Max Input Current: 50mA; Turn-Off Delay Time: 2µs; Current Transfer Ratio: 20%; Reverse Voltage: 6V; Power Dissipation: 250mW; Max Power Dissipation: 200mW; Approvals: UL; Forward Voltage: 1.18V; Max Operating Temperature: 100°C; Min Operating Temperature: -55°C; RoHS: Compliant; Lifecycle Status: Production; NexarPartId: 84323282; Weight: 855mg; Reverse Breakdown Voltage: 6V; Rise Time: 2µs; Case/Package: DIP; Max Output Voltage: 30V; Number of Elements: 1; Output Voltage: 30V; Mount: Through Hole; REACH SVHC: No SVHC; Length: 7.12mm; Input Current: 10mA; Collector Emitter Saturation Voltage: 500mV; Width: 6.5mm; Schedule B: 8541408000, 8541408000; Height: 5.08mm; Turn-On Delay Time: 2µs; Number of Pins: 6; Fall Time: 2µs; Radiation Hardening: No; Lead Free: Lead Free; Number of Channels: 1
U2 = CMP-2000-04954-1: as U8 on sheet Red_Driver; Packaging: Rail/Tube; Manufacturer URL: http://www.ti.com/; Package Reference: P8; Package Description: 8-Pin Double In-line Package, Body 9.59 x 6.35 mm, Pitch 2.54 mm; Package URL: http://www.ti.com/lit/ml/mpdi001b/mpdi001b.pdf; Type: Standard; Datasheet URL: http://www.ti.com/general/docs/lit/getliterature.tsp?genericPartNumber=NE555&fileType=pdf; Category: Timer; Package: 8PDIP; Datasheet Version: Rev. I, 09/2014
U7 = CMP-003-000056-1: as U6 on sheet Red_Driver; PN: BU4S81G2-TR; Datasheet: https://fscdn.rohm.com/en/products/databook/datasheet/ic/logic_switch/standard_logic/bu4s81g2-e.pdf
VR1 = CMP-07234-000047-1: TRIMMER 10KOHM 0.75W PC PIN SIDE; Manufacturer Series: 3006; Pin Diameter: 0.6mm; Resistance Tolerance: 10%; Actuator Type: SCREW; Number of Turns: 15; Insulation Resistance: 1GR; Pitch: 2.5mm; Power Rating: 750mW; Resistance Law: Linear; Temperature Coefficient: 100ppm/°C; Resistance: 10kR; Number of Terminals/Pins: 3; Actuator Orientation: Horizontal; Package Quantity: 100; Depth: 4.83mm; Width: 4.83mm; Termination: Pin; Packaging: Rail/Tube; Height: 6.35mm; Terminal Finish: Tin; Color: Blue; Thickness: 5.59mm; Lead Free: Lead Free; Min Operating Temperature: -55°C; Type: Potentiometer; Radiation Hardening: No; Weight: 0.04oz; Mount: Panel; RoHS Compliant: Yes; Length: 20.57mm; Tolerance: 10%; Number of Pins: 3; Taper: Linear; Military Standard: Not; Resistor Type: Cermet; Max Operating Temperature: 125°C; REACH SVHC: No SVHC; Technology: CERMET; Max Power Dissipation: 750mW; Series: 3006

## Nets that join several sheets
+12_LV: TSSI (C18.2 LV_IN.1 U4.5), Red_Driver (6 pins), RML (6 pins)
GND_LV: TSAL_Board_B (MH1.1 MH2.1 MH3.1 MH4.1), TSSI (5 pins), Red_Driver (11 pins), RML (8 pins)
BMS: TSSI (D5.2 LV_IN.3), Red_Driver (D8.2)
IMD: TSSI (D6.2 LV_IN.4), Red_Driver (D7.2)
NetBMS_TP_1: TSSI (D6.1 R26.1 U4.2), Red_Driver (BMS_TP.1 K2.1)
NetD5_1: TSSI (D5.1 R25.2 U4.1), Red_Driver (IMD_TP.1 K1.1)

## Assembly variants
Default: all parts fitted